# Altium schematic sheet ModuleXuLyAmThanhPT2314.SchDoc
size A
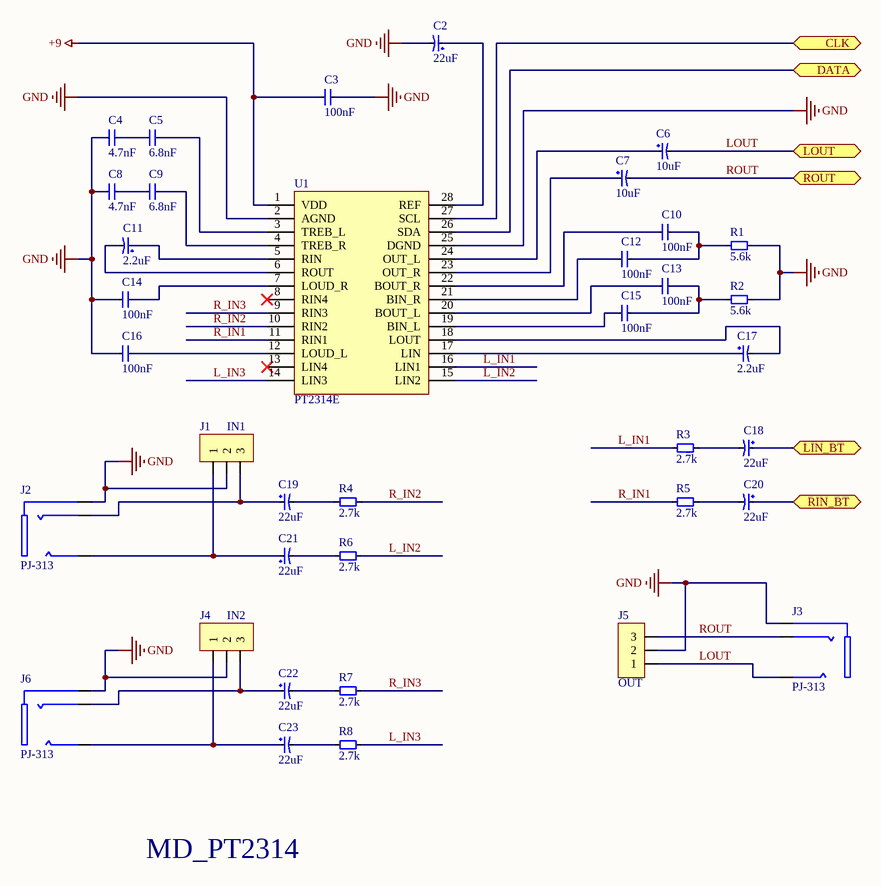
[diagram p0: ModuleXuLyAmThanhPT2314.SchDoc]

## Parts
C2  22uF  [C-ELE-1.5-4X7MM]
C3  100nF  [C-0805]
C4  4.7nF  [C-0805]
C5  6.8nF  [C-0805]
C6  10uF  [C-ELE-1.5-4X7MM]
C7  10uF  [C-ELE-1.5-4X7MM]
C8  4.7nF  [C-0805]
C9  6.8nF  [C-0805]
C10  100nF  [C-0805]
C11  2.2uF  [C-ELE-1.5-4X7MM]
C12  100nF  [C-0805]
C13  100nF  [C-0805]
C14  100nF  [C-0805]
C15  100nF  [C-0805]
C16  100nF  [C-0805]
C17  2.2uF  [C-ELE-1.5-4X7MM]
C18  22uF  [C-ELE-1.5-4X7MM]
C19  22uF  [C-ELE-1.5-4X7MM]
C20  22uF  [C-ELE-1.5-4X7MM]
C21  22uF  [C-ELE-1.5-4X7MM]
C22  22uF  [C-ELE-1.5-4X7MM]
C23  22uF  [C-ELE-1.5-4X7MM]
J1  IN1  [XH1X3M-2.54]
J2  PJ-313  [PJ-313]
J3  PJ-313  [PJ-313]
J4  IN2  [XH1X3M-2.54]
J5  OUT  [XH1X3M-2.54]
J6  PJ-313  [PJ-313]
R1  5.6k  [R-0805]
R2  5.6k  [R-0805]
R3  2.7k  [R-0805]
R4  2.7k  [R-0805]
R5  2.7k  [R-0805]
R6  2.7k  [R-0805]
R7  2.7k  [R-0805]
R8  2.7k  [R-0805]
U1  PT2314E  [SO28W-1.27-300MIL]

## Ports
CLK (bidir), DATA (bidir), LIN_BT (bidir), LOUT (bidir), RIN_BT (bidir), ROUT (bidir)

## Nets
+9: C3.1 U1.1(VDD)
GND: C2.2 C3.2 C4.1 C8.1 C14.1 C16.1 J1.2 J2.1 J3.1 J4.2 J5.2 J6.1 R1.2 R2.2 U1.2(AGND) U1.25(DGND)
CLK: U1.27(SCL) ; port CLK
DATA: U1.26(SDA) ; port DATA
L_IN1: R3.2 U1.16(LIN1)
L_IN2: R6.2 U1.15(LIN2)
L_IN3: R8.2 U1.14(LIN3)
LIN_BT: C18.1 ; port LIN_BT
LOUT: C6.2 J3.3 J5.1 ; port LOUT
R_IN1: R5.1 U1.11(RIN1)
R_IN2: R4.1 U1.10(RIN2)
R_IN3: R7.1 U1.9(RIN3)
RIN_BT: C20.1 ; port RIN_BT
ROUT: C7.2 J3.2 J5.3 ; port ROUT
NetC2_1: C2.1 U1.28(REF)
NetC4_2: C4.2 C5.1
NetC5_2: C5.2 U1.3(TREB_L)
NetC6_1: C6.1 U1.24(OUT_L)
NetC7_1: C7.1 U1.23(OUT_R)
NetC8_2: C8.2 C9.1
NetC9_2: C9.2 U1.4(TREB_R)
NetC10_1: C10.1 U1.22(BOUT_R)
NetC10_2: C10.2 C12.2 R1.1
NetC11_1: C11.1 U1.5(RIN)
NetC11_2: C11.2 U1.6(ROUT)
NetC12_1: C12.1 U1.21(BIN_R)
NetC13_1: C13.1 U1.20(BOUT_L)
NetC13_2: C13.2 C15.2 R2.1
NetC14_2: C14.2 U1.7(LOUD_R)
NetC15_1: C15.1 U1.19(BIN_L)
NetC16_2: C16.2 U1.12(LOUD_L)
NetC17_1: C17.1 U1.17(LIN)
NetC17_2: C17.2 U1.18(LOUT)
NetC18_2: C18.2 R3.1
NetC19_1: C19.1 J1.3 J2.2
NetC19_2: C19.2 R4.2
NetC20_2: C20.2 R5.2
NetC21_1: C21.1 J1.1 J2.3
NetC21_2: C21.2 R6.1
NetC22_1: C22.1 J4.3 J6.2
NetC22_2: C22.2 R7.2
NetC23_1: C23.1 J4.1 J6.3
NetC23_2: C23.2 R8.1

Not connected (* = marked no-connect by the designer): U1 8(RIN4)* 13(LIN4)*

## Notes on the sheet
- MD_PT2314

## Library data of the parts
C2 C6 C7 C11 C17-C23 = CAP-ELE: Cac Loai Tu Hoa
C3-C5 C8-C10 C12-C16 = CAP: Cac Loai Tu Khong Phan Cuc
J1 J4 J5 = XH1X3-2.54: Header 3 Chan XH 2.54mm
J2 J3 J6 = PJ-313: Jack Ket Noi Audio 3.5MM
R1-R8 = RES: Cac Loai Dien Tro
U1 = PT2314E: IC Xu Ly Am Thanh So